# Altium project BuzzSaw Motion Controller.PrjPCB
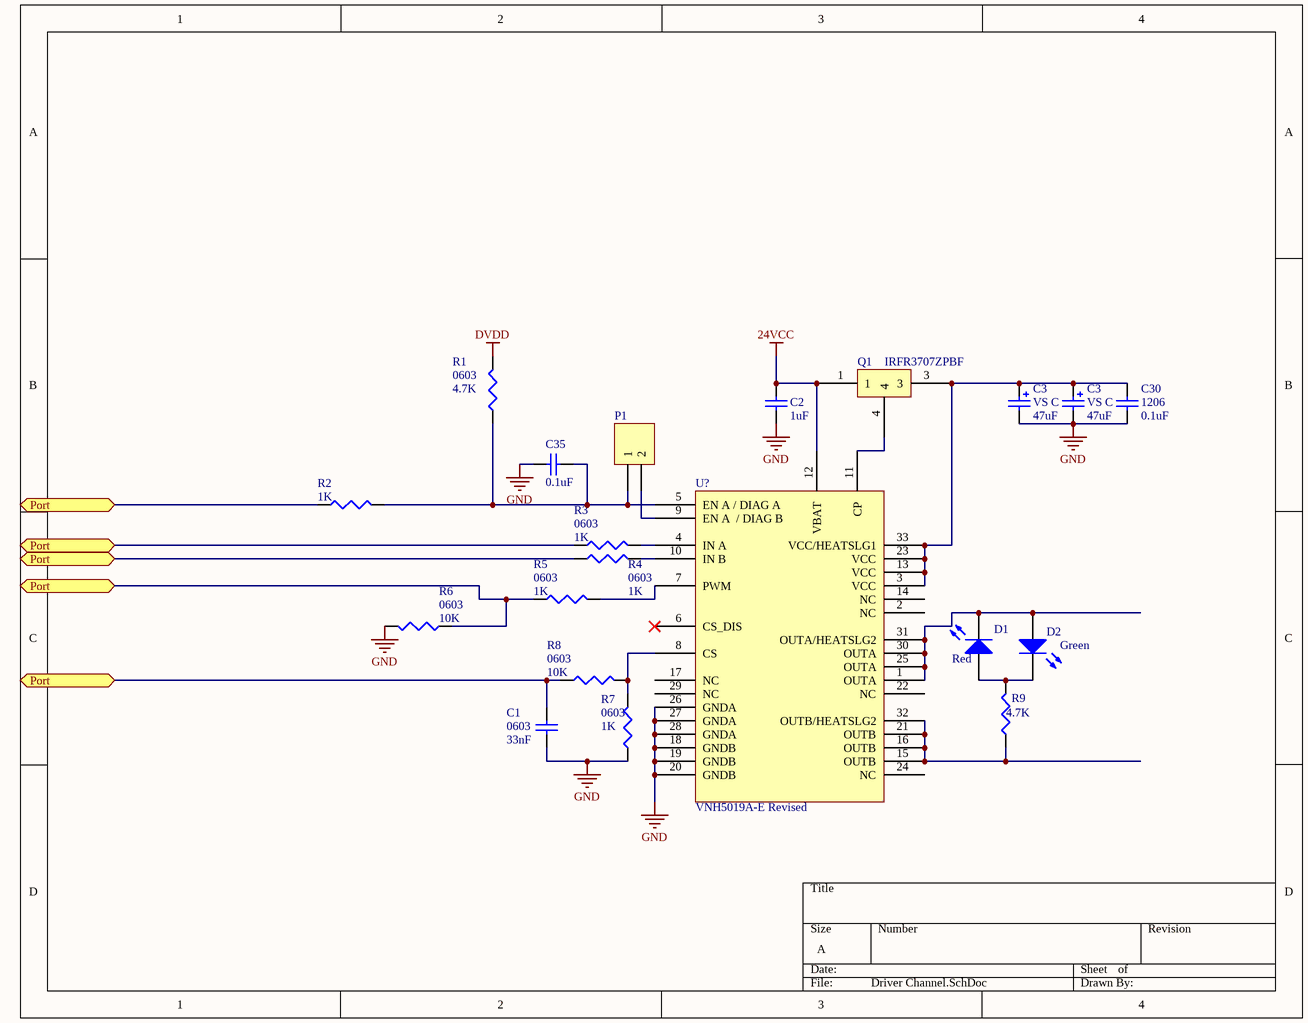
[diagram p0: Driver Channel.SchDoc]
1 sheet, 20 parts. Net scope: flat (ports and power ports of the same name join across sheets).

## Sheet Driver Channel.SchDoc
size A

### Parts
(Parts that share a designator on the sheet are numbered #1, #2 ... from top to bottom, then left to right.)
C1  0603  value 33nF  [1608[0603]]
C2  value 1uF  [1608[0603]]  (hidden comment: Cap Semi)
C3#1  VS C  value 47uF  [Panasonic VS C]
C3#2  VS C  value 47uF  [Panasonic VS C]
C30  1206  value 0.1uF  [C1206]
C35  value 0.1uF  [1608[0603]]  (hidden comment: Cap Semi)
D1  LED2  [3.2X1.6X1.1]  (value not drawn)
D2  LED2  [3.2X1.6X1.1]  (value not drawn)
P1  Header 2  [HDR1X2]  (value not drawn)
Q1  IRFR3707ZPBF  [IRFR3707ZPBF]
R1  0603  value 4.7K  [RESC1608L]
R2  value 1K  [RESC1608L]  (hidden comment: Res3)
R3  0603  value 1K  [RESC1608L]
R4  0603  value 1K  [RESC1608L]
R5  0603  value 1K  [RESC1608L]
R6  0603  value 10K  [RESC1608L]
R7  0603  value 1K  [RESC1608L]
R8  0603  value 10K  [RESC1608L]
R9  value 4.7K  [0805 SMD Resistor]  (hidden comment: Res3)
U?  VNH5019A-E Revised  [VNH5019A-E]

### Ports
Port

### Nets
24VCC: C2.2 Q1.1 U?.12(VBAT)
DVDD: R1.2
GND: C1.1 C2.1 C3#1.2 C3#2.2 C30.1 C35.1 R6.2 R7.1 U?.18(GNDB) U?.19(GNDB) U?.20(GNDB) U?.26(GNDA) U?.27(GNDA) U?.28(GNDA)
NetC1_2: C1.2 R2.1 R3.1 R4.1 R5.1 R6.1 R8.1 ; port Port
NetC3#1_1: C3#1.1 C3#2.1 C30.2 Q1.3 U?.3(VCC) U?.13(VCC) U?.23(VCC) U?.33(VCC/HEATSLG1)
NetC35_2: C35.2 P1.1 R1.1 R2.2 U?.5(EN_A_/_DIAG_A)
NetD1_1: D1.1(A) D2.2(K) R9.2
NetD1_2: D1.2(K) D2.1(A) U?.1(OUTA) U?.25(OUTA) U?.30(OUTA) U?.31(OUTA/HEATSLG2)
NetP1_2: P1.2 U?.9(EN_A__/_DIAG_B)
NetQ1_4: Q1.4 U?.11(CP)
NetR3_2: R3.2 U?.4(IN_A)
NetR4_2: R4.2 U?.10(IN_B)
NetR5_2: R5.2 U?.7(PWM)
NetR7_2: R7.2 R8.2 U?.8(CS)
NetR9_1: R9.1 U?.15(OUTB) U?.16(OUTB) U?.21(OUTB) U?.32(OUTB/HEATSLG2)

Not connected (* = marked no-connect by the designer): U? 2(NC) 6(CS_DIS)* 14(NC) 17(NC) 22(NC) 24(NC) 29(NC)

### Notes on the sheet
- (near D1) Red
- (near D2) Green

### Library data of the parts
C1 C2 C30 C35 = Cap Semi: Capacitor (Semiconductor SIM Model); Published: 8-Jun-2000; LatestRevisionDate: 29-May-2009; LatestRevisionNote: IPC-7351 Footprint Added.; PackageReference: C1206; Publisher: Altium Limited; PackageDescription: Chip Capacitor
C3#1 C3#2 = Cap Pol2: Polarized Capacitor (Axial); Published: 8-Jun-2000; LatestRevisionDate: 17-Jul-2002; LatestRevisionNote: Re-released for DXP Platform.; PackageReference: POLAR0.8; Publisher: Altium Limited; PackageDescription: Polarized Capacitor; 2 Leads
D1 D2 = LED2: Typical RED, GREEN, YELLOW, AMBER GaAs LED; Published: 8-Jun-2000; LatestRevisionDate: 17-Jul-2002; LatestRevisionNote: Re-released for DXP Platform.; PackageVersion: Feb-2002; PackageReference: 3.2X1.6X1.1; Publisher: Altium Limited; PackageDescription: SM LED; 2 Flat Leads
P1 = Header 2: Header, 2-Pin; LatestRevisionDate: 17-Jul-2002; LatestRevisionNote: Re-released for DXP Platform.; Publisher: Altium Limited
Q1 = IRFR3707ZPBF: Power FET
R1-R9 = Res3: Resistor; Published: 8-Jun-2000; LatestRevisionDate: 29-May-2009; LatestRevisionNote: IPC-7351 Footprint Added.; PackageReference: J1-0603; Publisher: Altium Limited; PackageDescription: Chip Resistor
U? = VNH5019A-E Revised: VNH5019A-E H-Bridge